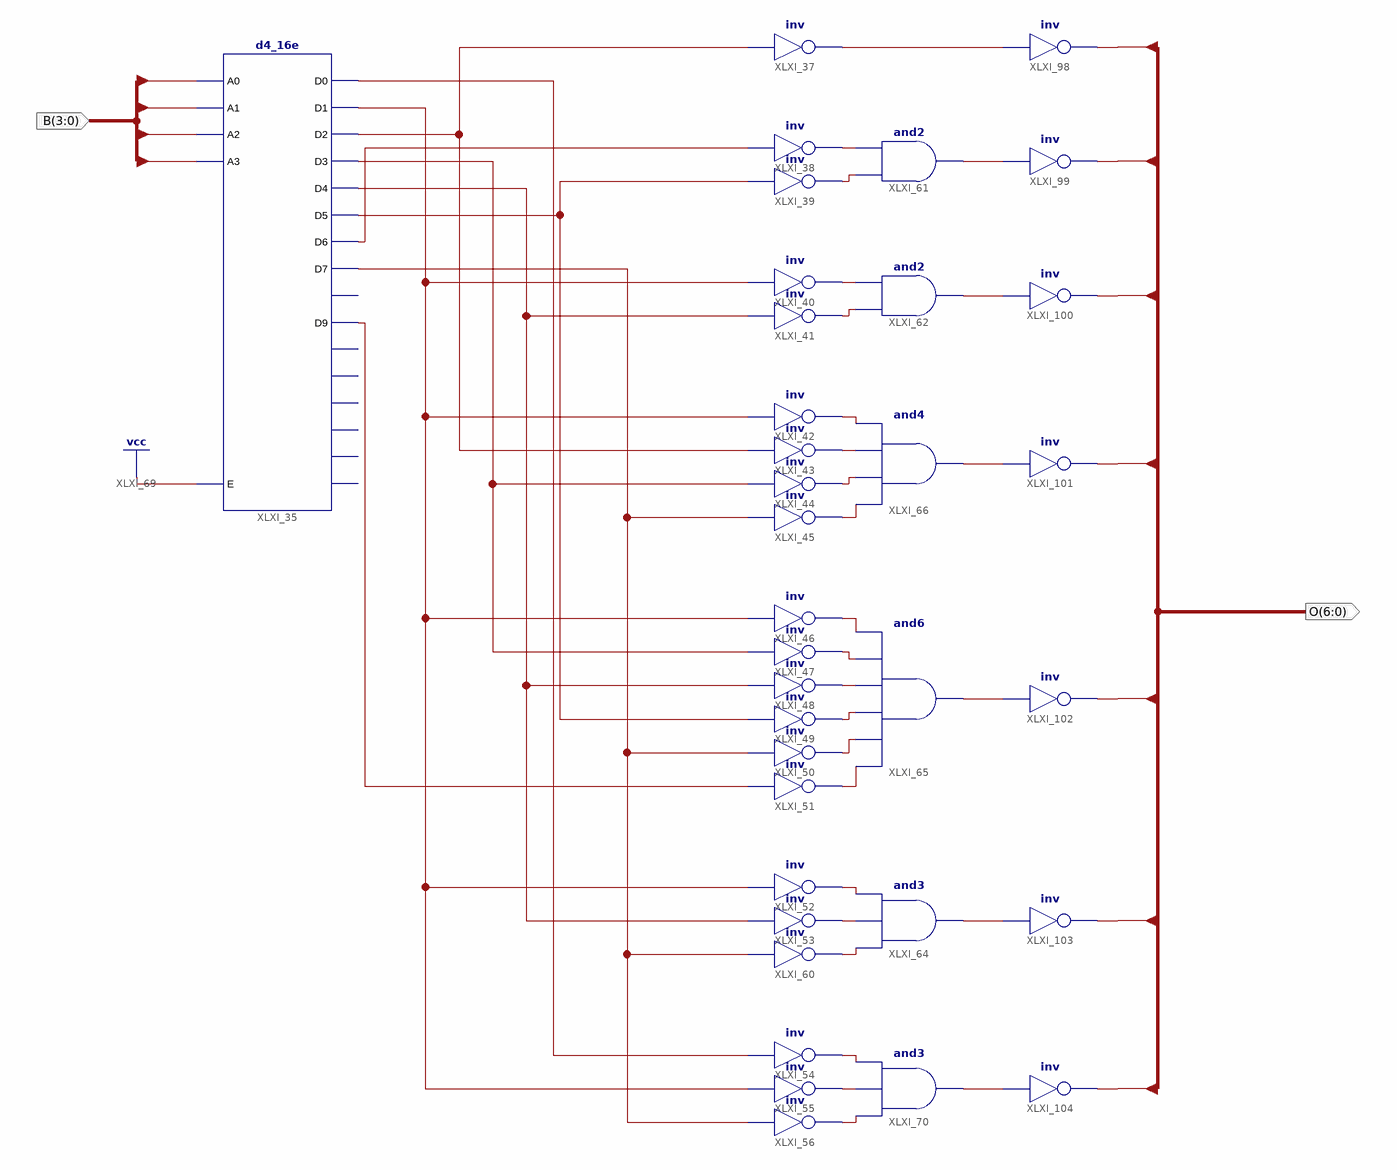
[diagram p0: schematic sheet 1]
// Xilinx ISE schematic BCDto7SEG.sch (spartan3e) as structural Verilog: 35 symbols, 2 ports
module BCDto7SEG (
  input  [3:0] B,
  output [6:0] O
);

  wire XLXN_51, XLXN_52, XLXN_56, XLXN_57, XLXN_58, XLXN_60, XLXN_65, XLXN_67, XLXN_70, XLXN_76, XLXN_77,
       XLXN_78, XLXN_79, XLXN_80, XLXN_81, XLXN_82, XLXN_83, XLXN_84, XLXN_85, XLXN_86, XLXN_87, XLXN_88,
       XLXN_89, XLXN_97, XLXN_98, XLXN_99, XLXN_100, XLXN_101, XLXN_102, XLXN_164, XLXN_165, XLXN_166,
       XLXN_167, XLXN_168, XLXN_169, XLXN_170;

  d4_16e XLXI_35 (
    .A0(B[0]), .A1(B[1]), .A2(B[2]), .A3(B[3]), .E(1'b1), .D0(XLXN_67), .D1(XLXN_56), .D2(XLXN_51),
    .D3(XLXN_57), .D4(XLXN_65), .D5(XLXN_60), .D6(XLXN_52), .D7(XLXN_58), .D9(XLXN_70));  // open: D10, D11, D12, D13, D14, D15, D8
  not XLXI_98 (O[2], XLXN_170);
  not XLXI_99 (O[1], XLXN_169);
  not XLXI_100 (O[0], XLXN_168);
  not XLXI_101 (O[5], XLXN_167);
  not XLXI_102 (O[4], XLXN_166);
  not XLXI_103 (O[3], XLXN_165);
  not XLXI_104 (O[6], XLXN_164);
  not XLXI_39 (XLXN_77, XLXN_60);
  not XLXI_37 (XLXN_170, XLXN_51);
  not XLXI_38 (XLXN_76, XLXN_52);
  not XLXI_40 (XLXN_78, XLXN_56);
  not XLXI_41 (XLXN_79, XLXN_65);
  not XLXI_42 (XLXN_80, XLXN_56);
  not XLXI_45 (XLXN_83, XLXN_58);
  not XLXI_43 (XLXN_81, XLXN_51);
  not XLXI_44 (XLXN_82, XLXN_57);
  not XLXI_46 (XLXN_84, XLXN_56);
  not XLXI_47 (XLXN_85, XLXN_57);
  not XLXI_48 (XLXN_87, XLXN_65);
  not XLXI_49 (XLXN_86, XLXN_60);
  not XLXI_50 (XLXN_88, XLXN_58);
  not XLXI_51 (XLXN_89, XLXN_70);
  not XLXI_53 (XLXN_98, XLXN_65);
  not XLXI_52 (XLXN_97, XLXN_56);
  not XLXI_54 (XLXN_102, XLXN_67);
  not XLXI_55 (XLXN_101, XLXN_56);
  not XLXI_56 (XLXN_100, XLXN_58);
  not XLXI_60 (XLXN_99, XLXN_58);
  and XLXI_61 (XLXN_169, XLXN_77, XLXN_76);
  and XLXI_62 (XLXN_168, XLXN_79, XLXN_78);
  and XLXI_64 (XLXN_165, XLXN_99, XLXN_98, XLXN_97);
  and XLXI_65 (XLXN_166, XLXN_89, XLXN_88, XLXN_86, XLXN_87, XLXN_85, XLXN_84);
  and XLXI_66 (XLXN_167, XLXN_83, XLXN_82, XLXN_81, XLXN_80);
  and XLXI_70 (XLXN_164, XLXN_100, XLXN_101, XLXN_102);
endmodule
